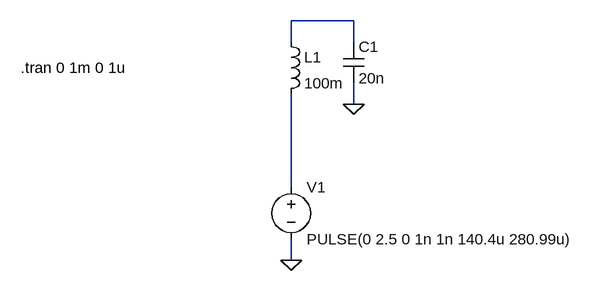
[diagram p0: schematic Draft3.asc]
Draft3.asc, the LTspice schematic file:
Version 4
SHEET 1 880 680
WIRE 192 128 96 128
WIRE 96 160 96 128
WIRE 192 160 192 128
WIRE 192 256 192 224
WIRE 96 384 96 240
WIRE 96 496 96 464
FLAG 192 256 0
FLAG 96 496 0
SYMBOL ind 80 144 R0
SYMATTR InstName L1
SYMATTR Value 100m
SYMBOL cap 176 160 R0
SYMATTR InstName C1
SYMATTR Value 20n
SYMBOL voltage 96 368 R0
WINDOW 123 0 0 Left 0
WINDOW 39 0 0 Left 0
SYMATTR InstName V1
SYMATTR Value PULSE(0 2.5 0 1n 1n 140.4u 280.99u)
TEXT -320 200 Left 2 !.tran 0 1m 0 1u

The netlist it stands for:
* Draft3.asc
L1 N001 N002 100m
C1 N001 0 20n
V1 N002 0 PULSE(0 2.5 0 1n 1n 140.4u 280.99u)
.tran 0 1m 0 1u
.backanno
.end